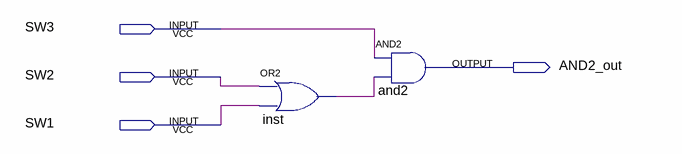
[diagram p0: schematic sheet]
// Quartus schematic and_two.bdf as structural Verilog: 2 symbols, 4 pins
module and_two (
  input  SW3,
  input  SW2,
  input  SW1,
  output AND2_out
);

  wire inst_out;

  or inst (inst_out, SW2, SW1);
  and and2 (AND2_out, SW3, inst_out);
endmodule
